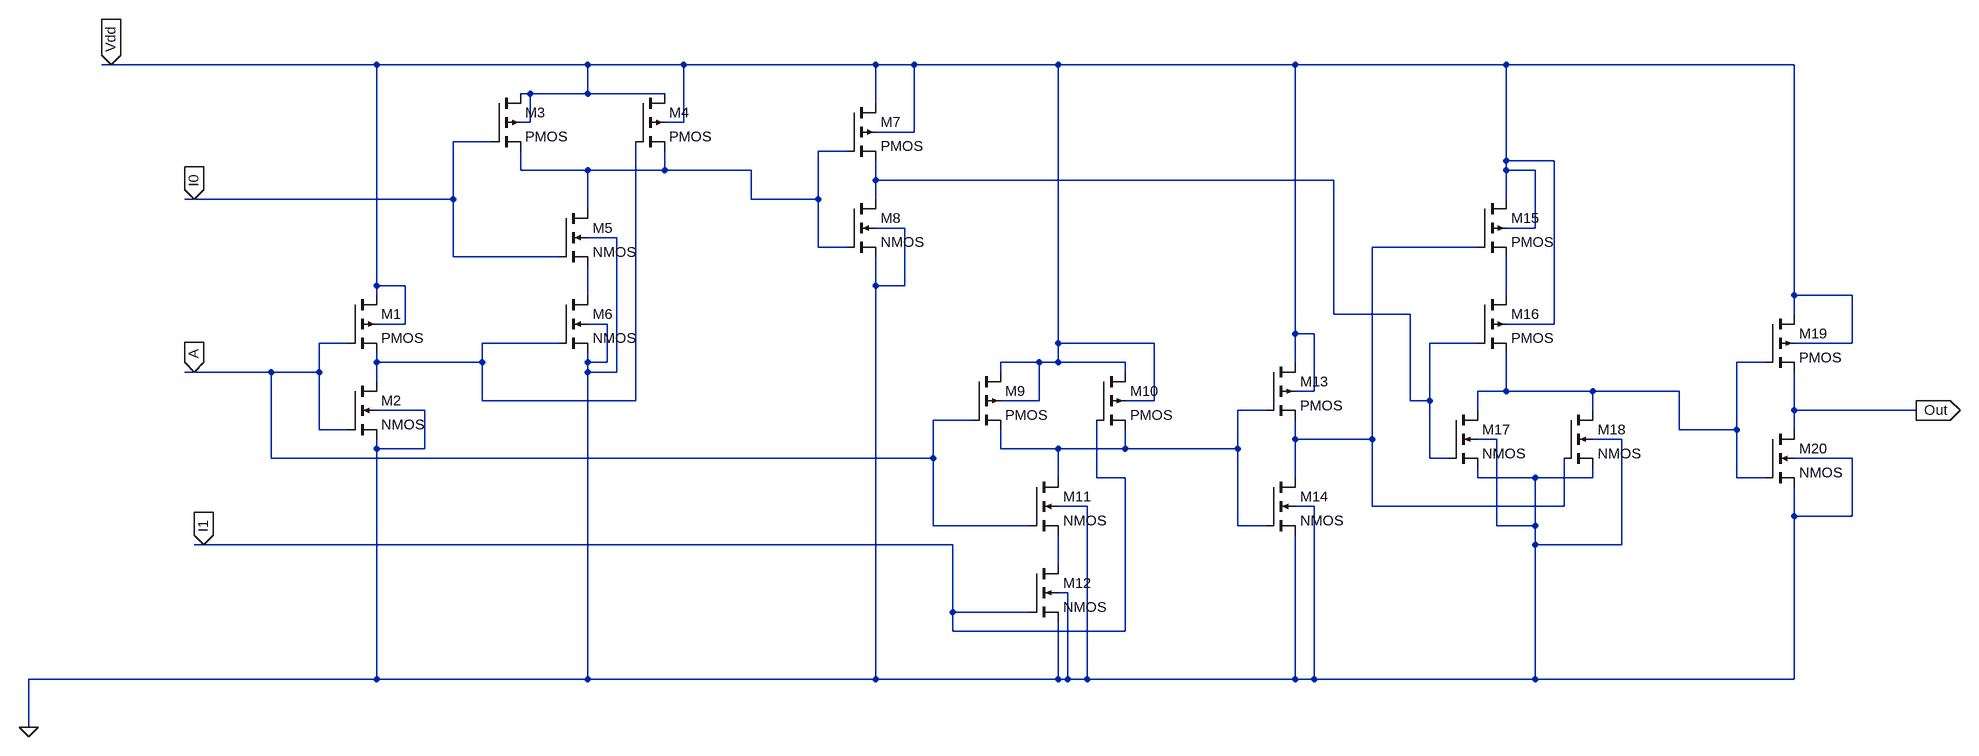
[diagram p0: schematic Mux2to1.asc]
Mux2to1.asc, the LTspice schematic file:
Version 4.1
SHEET 1 3220 1400
WIRE 80 144 64 144
WIRE 544 144 80 144
WIRE 896 144 544 144
WIRE 1056 144 896 144
WIRE 1376 144 1056 144
WIRE 1440 144 1376 144
WIRE 1680 144 1440 144
WIRE 2080 144 1680 144
WIRE 2432 144 2080 144
WIRE 2912 144 2432 144
WIRE 800 192 784 192
WIRE 896 192 896 144
WIRE 896 192 800 192
WIRE 1024 192 896 192
WIRE 1376 208 1376 144
WIRE 800 240 800 192
WIRE 800 240 784 240
WIRE 1056 240 1056 144
WIRE 1056 240 1024 240
WIRE 1440 256 1440 144
WIRE 1440 256 1376 256
WIRE 736 272 672 272
WIRE 1328 288 1280 288
WIRE 2432 304 2432 144
WIRE 2512 304 2432 304
WIRE 784 320 784 288
WIRE 896 320 784 320
WIRE 1024 320 1024 288
WIRE 1024 320 896 320
WIRE 1168 320 1024 320
WIRE 2432 320 2432 304
WIRE 2480 320 2432 320
WIRE 1376 336 1376 304
WIRE 2144 336 1376 336
WIRE 240 368 224 368
WIRE 672 368 672 272
WIRE 672 368 240 368
WIRE 1168 368 1168 320
WIRE 1280 368 1280 288
WIRE 1280 368 1168 368
WIRE 1376 368 1376 336
WIRE 2432 368 2432 320
WIRE 896 384 896 320
WIRE 1424 416 1376 416
WIRE 2480 416 2480 320
WIRE 2480 416 2432 416
WIRE 944 432 896 432
WIRE 1280 448 1280 368
WIRE 1328 448 1280 448
WIRE 2384 448 2208 448
WIRE 672 464 672 368
WIRE 848 464 672 464
WIRE 544 512 544 144
WIRE 592 512 544 512
WIRE 1376 512 1376 464
WIRE 1424 512 1424 416
WIRE 1424 512 1376 512
WIRE 544 528 544 512
WIRE 896 528 896 480
WIRE 2432 528 2432 464
WIRE 2912 528 2912 144
WIRE 3008 528 2912 528
WIRE 2144 560 2144 336
WIRE 2272 560 2144 560
WIRE 2912 560 2912 528
WIRE 592 576 592 512
WIRE 592 576 544 576
WIRE 928 576 896 576
WIRE 2512 576 2512 304
WIRE 2512 576 2432 576
WIRE 2080 592 2080 144
WIRE 2112 592 2080 592
WIRE 496 608 448 608
WIRE 848 608 720 608
WIRE 1680 608 1680 144
WIRE 1840 608 1680 608
WIRE 2384 608 2304 608
WIRE 3008 608 3008 528
WIRE 3008 608 2912 608
WIRE 544 640 544 624
WIRE 720 640 720 608
WIRE 720 640 544 640
WIRE 896 640 896 624
WIRE 928 640 928 576
WIRE 928 640 896 640
WIRE 1648 640 1584 640
WIRE 1680 640 1680 608
WIRE 1680 640 1648 640
WIRE 1792 640 1680 640
WIRE 2080 640 2080 592
WIRE 2864 640 2816 640
WIRE 240 656 224 656
WIRE 368 656 240 656
WIRE 448 656 448 608
WIRE 448 656 368 656
WIRE 896 656 896 640
WIRE 944 656 944 432
WIRE 944 656 896 656
WIRE 1584 656 1584 640
WIRE 1792 656 1792 640
WIRE 544 672 544 640
WIRE 2112 688 2112 592
WIRE 2112 688 2080 688
WIRE 2432 688 2432 624
WIRE 2432 688 2384 688
WIRE 2576 688 2432 688
WIRE 2720 688 2576 688
WIRE 720 704 720 640
WIRE 976 704 976 272
WIRE 976 704 720 704
WIRE 1648 704 1648 640
WIRE 1648 704 1584 704
WIRE 1840 704 1840 608
WIRE 1840 704 1792 704
WIRE 2272 704 2272 560
WIRE 2304 704 2304 608
WIRE 2304 704 2272 704
WIRE 624 720 544 720
WIRE 2032 720 1984 720
WIRE 2384 720 2384 688
WIRE 2576 720 2576 688
WIRE 2912 720 2912 656
WIRE 3120 720 2912 720
WIRE 1536 736 1472 736
WIRE 448 752 448 656
WIRE 496 752 448 752
WIRE 2720 752 2720 688
WIRE 2816 752 2816 640
WIRE 2816 752 2720 752
WIRE 2912 752 2912 720
WIRE 2080 768 2080 736
WIRE 2208 768 2208 448
WIRE 2208 768 2080 768
WIRE 2416 768 2384 768
WIRE 2624 768 2576 768
WIRE 544 784 544 768
WIRE 624 784 624 720
WIRE 624 784 544 784
WIRE 1584 784 1584 752
WIRE 1680 784 1584 784
WIRE 1792 784 1792 752
WIRE 1792 784 1680 784
WIRE 1984 784 1984 720
WIRE 1984 784 1792 784
WIRE 368 800 368 656
WIRE 1472 800 1472 736
WIRE 1472 800 368 800
WIRE 2304 800 2304 704
WIRE 2336 800 2304 800
WIRE 3008 800 2912 800
WIRE 1680 832 1680 784
WIRE 1744 832 1744 736
WIRE 1792 832 1744 832
WIRE 2080 832 2080 768
WIRE 2384 832 2384 816
WIRE 2480 832 2384 832
WIRE 2576 832 2576 816
WIRE 2576 832 2480 832
WIRE 2816 832 2816 752
WIRE 2864 832 2816 832
WIRE 1728 880 1680 880
WIRE 2112 880 2080 880
WIRE 2208 880 2208 768
WIRE 2528 880 2528 800
WIRE 2528 880 2208 880
WIRE 2912 896 2912 848
WIRE 3008 896 3008 800
WIRE 3008 896 2912 896
WIRE 1472 912 1472 800
WIRE 1632 912 1472 912
WIRE 1984 912 1984 784
WIRE 2032 912 1984 912
WIRE 2416 912 2416 768
WIRE 2480 912 2480 832
WIRE 2480 912 2416 912
WIRE 256 944 240 944
WIRE 1504 944 256 944
WIRE 2480 944 2480 912
WIRE 2624 944 2624 768
WIRE 2624 944 2480 944
WIRE 1680 976 1680 928
WIRE 1696 1024 1680 1024
WIRE 1504 1056 1504 944
WIRE 1632 1056 1504 1056
WIRE 1504 1088 1504 1056
WIRE 1792 1088 1792 832
WIRE 1792 1088 1504 1088
WIRE 544 1168 544 784
WIRE 544 1168 -64 1168
WIRE 896 1168 896 656
WIRE 896 1168 544 1168
WIRE 1376 1168 1376 512
WIRE 1376 1168 896 1168
WIRE 1680 1168 1680 1072
WIRE 1680 1168 1376 1168
WIRE 1696 1168 1696 1024
WIRE 1696 1168 1680 1168
WIRE 1728 1168 1728 880
WIRE 1728 1168 1696 1168
WIRE 2080 1168 2080 928
WIRE 2080 1168 1728 1168
WIRE 2112 1168 2112 880
WIRE 2112 1168 2080 1168
WIRE 2480 1168 2480 944
WIRE 2480 1168 2112 1168
WIRE 2912 1168 2912 896
WIRE 2912 1168 2480 1168
WIRE -64 1248 -64 1168
FLAG -64 1248 0
FLAG 240 368 I0
IOPIN 240 368 In
FLAG 256 944 I1
IOPIN 256 944 In
FLAG 240 656 A
IOPIN 240 656 In
FLAG 80 144 Vdd
IOPIN 80 144 In
FLAG 3120 720 Out
IOPIN 3120 720 Out
SYMBOL pmos4 496 528 R0
SYMATTR InstName M1
SYMBOL nmos4 496 672 R0
SYMATTR InstName M2
SYMBOL pmos4 736 192 R0
SYMATTR InstName M3
SYMBOL pmos4 976 192 R0
SYMATTR InstName M4
SYMBOL nmos4 848 384 R0
SYMATTR InstName M5
SYMBOL nmos4 848 528 R0
SYMATTR InstName M6
SYMBOL pmos4 1328 208 R0
SYMATTR InstName M7
SYMBOL nmos4 1328 368 R0
SYMATTR InstName M8
SYMBOL pmos4 1536 656 R0
SYMATTR InstName M9
SYMBOL pmos4 1744 656 R0
SYMATTR InstName M10
SYMBOL nmos4 1632 832 R0
SYMATTR InstName M11
SYMBOL nmos4 1632 976 R0
SYMATTR InstName M12
SYMBOL pmos4 2032 640 R0
SYMATTR InstName M13
SYMBOL nmos4 2032 832 R0
SYMATTR InstName M14
SYMBOL pmos4 2384 368 R0
SYMATTR InstName M15
SYMBOL pmos4 2384 528 R0
SYMATTR InstName M16
SYMBOL nmos4 2336 720 R0
SYMATTR InstName M17
SYMBOL nmos4 2528 720 R0
SYMATTR InstName M18
SYMBOL pmos4 2864 560 R0
SYMATTR InstName M19
SYMBOL nmos4 2864 752 R0
SYMATTR InstName M20

The netlist it stands for:
* Mux2to1.asc
M1 Vdd A N006 Vdd PMOS
M2 N006 A 0 0 NMOS
M3 Vdd I0 N001 Vdd PMOS
M4 Vdd N006 N001 Vdd PMOS
M5 N001 I0 N004 0 NMOS
M6 N004 N006 0 0 NMOS
M7 Vdd N001 N002 Vdd PMOS
M8 N002 N001 0 0 NMOS
M9 Vdd A N008 Vdd PMOS
M10 Vdd I1 N008 Vdd PMOS
M11 N008 A N009 0 NMOS
M12 N009 I1 0 0 NMOS
M13 Vdd N008 N003 Vdd PMOS
M14 N003 N008 0 0 NMOS
M15 Vdd N003 N005 Vdd PMOS
M16 N005 N002 N007 Vdd PMOS
M17 N007 N002 0 0 NMOS
M18 N007 N003 0 0 NMOS
M19 Vdd N007 Out Vdd PMOS
M20 Out N007 0 0 NMOS
.model NMOS NMOS
.model PMOS PMOS
.lib standard.mos
.backanno
.end